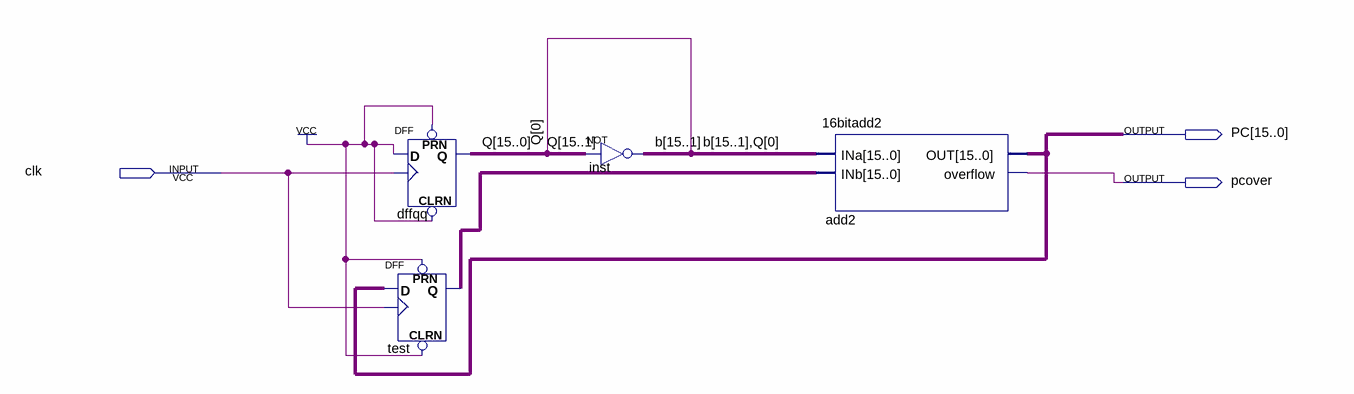
[diagram p0: schematic sheet]
// Quartus schematic pc.bdf as structural Verilog: 4 symbols, 3 pins
module pc (
  input  clk,
  output [15:0] PC,
  output pcover
);

  wire [15:0] Q, test_q;
  wire [15:1] b;

  DFF dffqq[15:0] (.CLRN(1'b1), .CLK(clk), .D(1'b1), .PRN(1'b1), .Q(Q));
  DFF test[15:0] (.CLRN(1'b1), .CLK(clk), .D(PC), .PRN(1'b1), .Q(test_q));
  assign b = ~Q[15:1];  // NOT inst, 15 bits wide
  \16bitadd2  add2 (.INa({b, Q[0]}), .INb(test_q), .OUT(PC), .overflow(pcover));
endmodule
